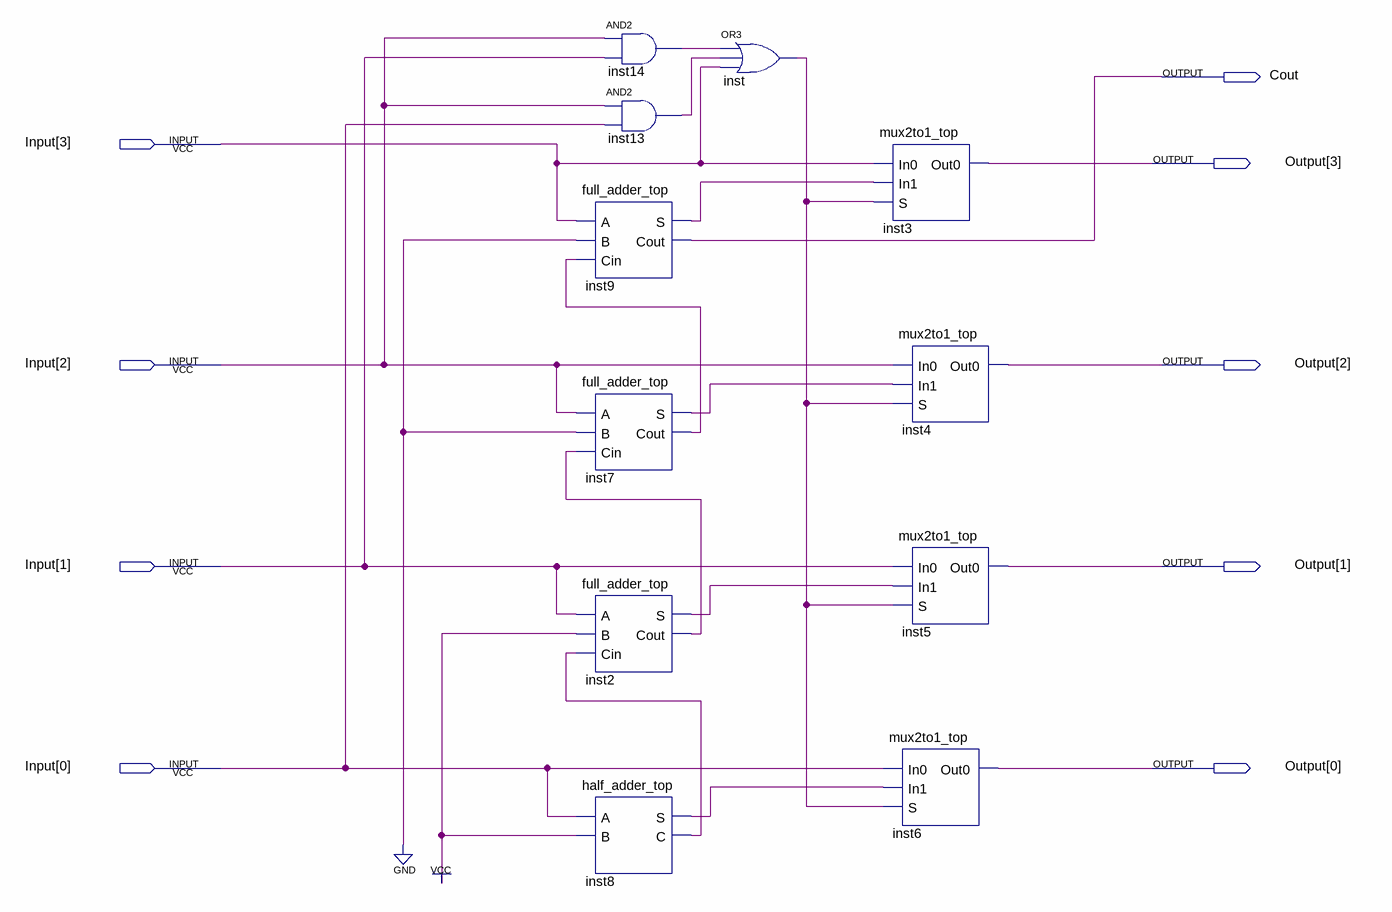
[diagram p0: schematic sheet]
// Quartus schematic mod3_bcd.bdf as structural Verilog: 11 symbols, 9 pins
module mod3_bcd (
  input  [3:0] Input,
  output Cout,
  output [3:0] Output
);

  wire inst2_cout, inst2_s, inst7_cout, inst7_s, inst8_c, inst8_s, inst9_s, inst13_out, inst14_out, inst_out;

  full_adder_top inst9 (.A(Input[3]), .B(1'b0), .Cin(inst7_cout), .S(inst9_s), .Cout(Cout));
  full_adder_top inst7 (.A(Input[2]), .B(1'b0), .Cin(inst2_cout), .S(inst7_s), .Cout(inst7_cout));
  full_adder_top inst2 (.A(Input[1]), .B(1'b1), .Cin(inst8_c), .S(inst2_s), .Cout(inst2_cout));
  half_adder_top inst8 (.A(Input[0]), .B(1'b1), .S(inst8_s), .C(inst8_c));
  and inst14 (inst14_out, Input[2], Input[1]);
  and inst13 (inst13_out, Input[2], Input[0]);
  or inst (inst_out, inst14_out, inst13_out, Input[3]);
  mux2to1_top inst3 (.In0(Input[3]), .In1(inst9_s), .S(inst_out), .Out0(Output[3]));
  mux2to1_top inst4 (.In0(Input[2]), .In1(inst7_s), .S(inst_out), .Out0(Output[2]));
  mux2to1_top inst5 (.In0(Input[1]), .In1(inst2_s), .S(inst_out), .Out0(Output[1]));
  mux2to1_top inst6 (.In0(Input[0]), .In1(inst8_s), .S(inst_out), .Out0(Output[0]));
endmodule
